# Altium schematic sheet PWM_Generator.SchDoc
size A4; SheetNumber: 7; SheetTotal: 7
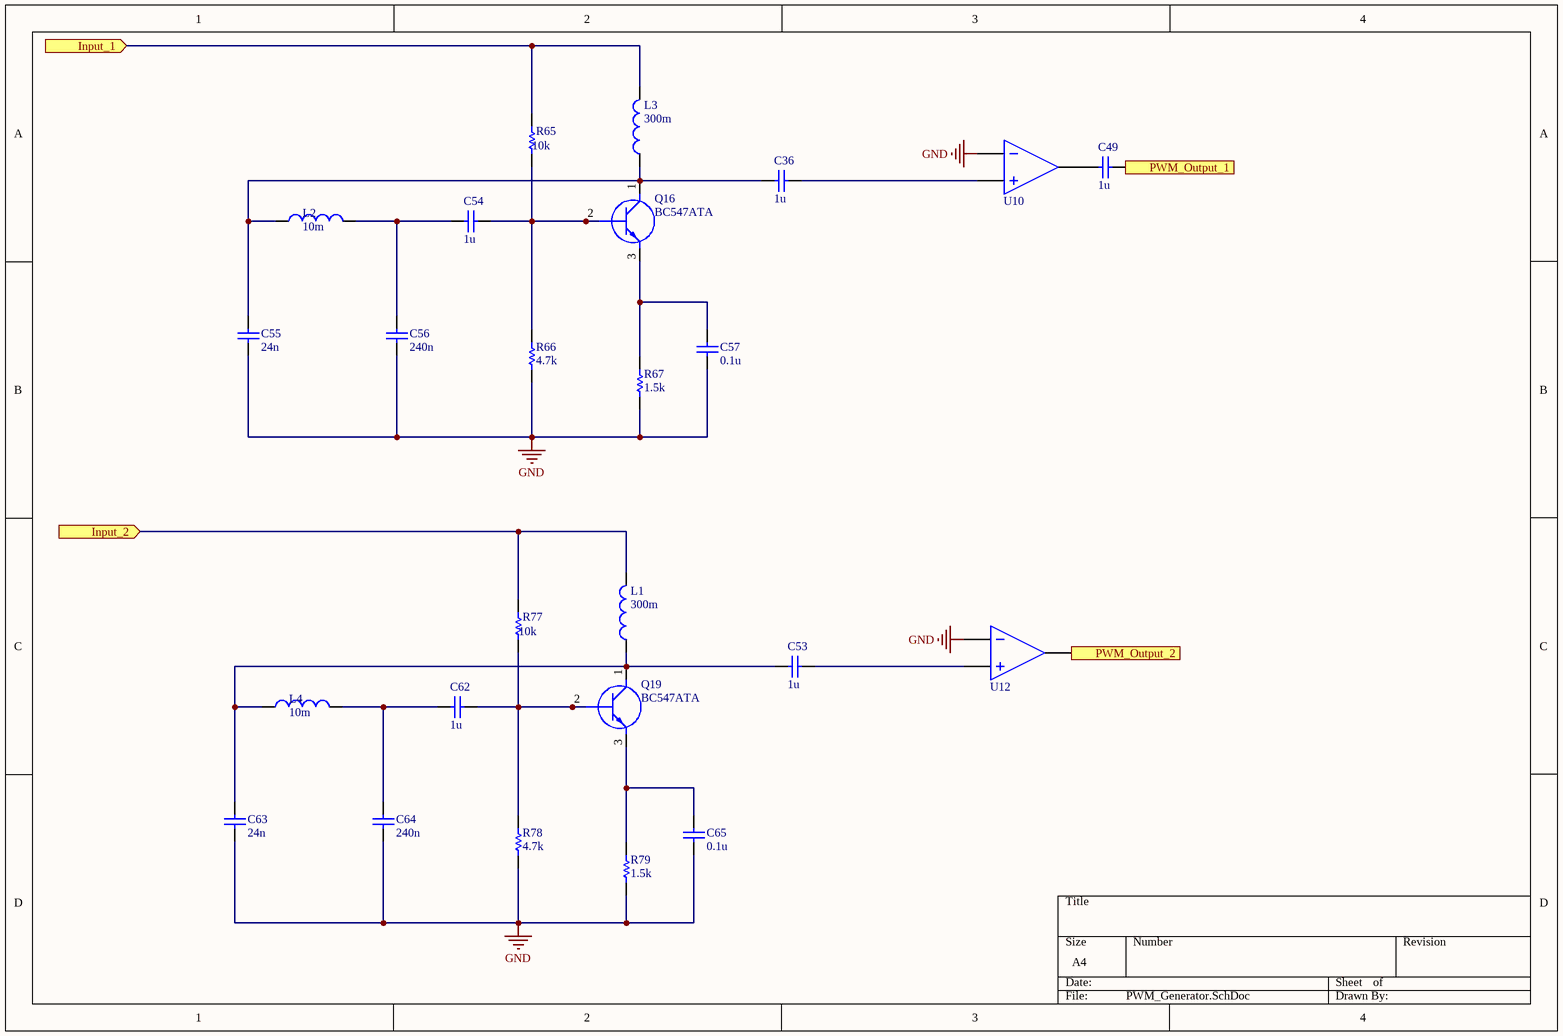
[diagram p0: PWM_Generator.SchDoc]

## Parts
C36  value 1u  (hidden comment: Capacitor)
C49  value 1u  (hidden comment: Capacitor)
C53  value 1u  (hidden comment: Capacitor)
C54  value 1u  (hidden comment: Capacitor)
C55  value 24n  (hidden comment: Capacitor)
C56  value 240n  (hidden comment: Capacitor)
C57  value 0.1u  (hidden comment: Capacitor)
C62  value 1u  (hidden comment: Capacitor)
C63  value 24n  (hidden comment: Capacitor)
C64  value 240n  (hidden comment: Capacitor)
C65  value 0.1u  (hidden comment: Capacitor)
L1  value 300m  (hidden comment: Inductor)
L2  value 10m  (hidden comment: Inductor)
L3  value 300m  (hidden comment: Inductor)
L4  value 10m  (hidden comment: Inductor)
Q16  BC547ATA  [TO-92_(TO-226)]
Q19  BC547ATA  [TO-92_(TO-226)]
R65  value 10k  (hidden comment: Resistor)
R66  value 4.7k  (hidden comment: Resistor)
R67  value 1.5k  (hidden comment: Resistor)
R77  value 10k  (hidden comment: Resistor)
R78  value 4.7k  (hidden comment: Resistor)
R79  value 1.5k  (hidden comment: Resistor)
U10  Ideal Comparator  (value not drawn)
U12  Ideal Comparator  (value not drawn)

## Ports
Input_1 (in), Input_2 (in), PWM_Output_1 (out), PWM_Output_2 (out)

## Nets
GND: C55.1 C56.1 C57.1 C63.1 C64.1 C65.1 R66.1 R67.1 R78.1 R79.1 U10.1(IN-) U12.1(IN-)
Input_1: L3.2 R65.2 ; port Input_1
Input_2: L1.2 R77.2 ; port Input_2
PWM_Output_1: C49.2 ; port PWM_Output_1
PWM_Output_2: U12.3(OUT) ; port PWM_Output_2
NetC36_1: C36.1 C55.2 L2.1 L3.1 Q16.1(C)
NetC36_2: C36.2 U10.2(IN+)
NetC49_1: C49.1 U10.3(OUT)
NetC53_1: C53.1 C63.2 L1.1 L4.1 Q19.1(C)
NetC53_2: C53.2 U12.2(IN+)
NetC54_1: C54.1 C56.2 L2.2
NetC54_2: C54.2 Q16.2(B) R65.1 R66.2
NetC57_2: C57.2 Q16.3(E) R67.2
NetC62_1: C62.1 C64.2 L4.2
NetC62_2: C62.2 Q19.2(B) R77.1 R78.2
NetC65_2: C65.2 Q19.3(E) R79.2

## Library data of the parts
C36 C49 C53-C57 C62-C65 = Capacitor: SimulationGenericComponent: True
L1-L4 = Inductor: SimulationGenericComponent: True
Q16 Q19 = BC547ATA: Transistor BJT NPN; Manufacturer_Name: onsemi; Datasheet Link: https://www.onsemi.com/pub/Collateral/BC550-D.pdf; Manufacturer_Part_Number: BC547ATA; Mouser Part Number: 512-BC547ATA; Mouser Price/Stock: https://www.mouser.co.uk/ProductDetail/onsemi-Fairchild/BC547ATA?qs=ljbEvF4DwOMRdLfuzO8N4w%3D%3D; Arrow Part Number: BC547ATA; Arrow Price/Stock: https://www.arrow.com/en/products/bc547ata/on-semiconductor?region=europe
R65-R67 R77-R79 = Resistor: TC1: 0; SimulationGenericComponent: True; TC2: 0
U10 = Comparator: VHIGH: 3.3; VLOW: 0; VHYS: 50m; SimulationGenericComponent: True
U12 = Comparator: VHIGH: 5; VLOW: 100m; VHYS: 50m; SimulationGenericComponent: True